# Altium schematic sheet STM32F405RGT6 .schdoc
size A4
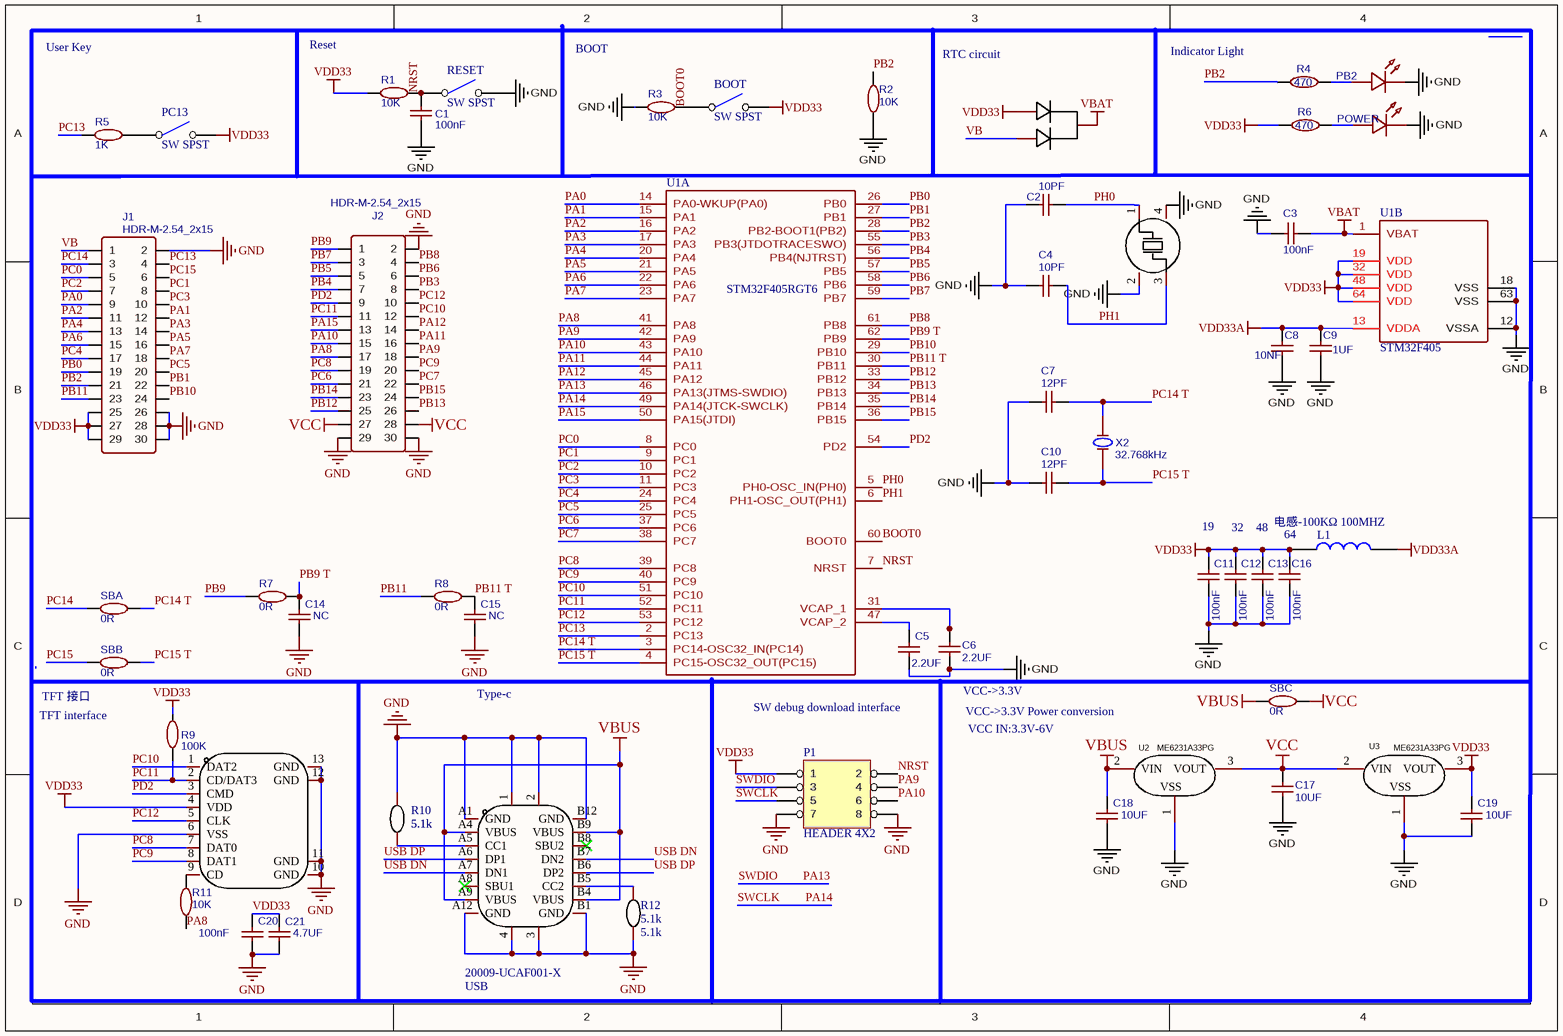
[diagram p0: STM32F405RGT6 .schdoc]

## Parts
BOOT  SW SPST  [KEY-SMD1]
C1  100nF  [C0603]
C2  10PF  [C0603]
C3  100nF  [C0603]
C4  10PF  [C0603]
C5  2.2UF  [C0603]
C6  2.2UF  [C0603]
C7  12PF  [C0603]
C8  10NF  [C0603]
C9  1UF  [C0603]
C10  12PF  [C0603]
C11  100nF  [C0603]
C12  100nF  [C0603]
C13  100nF  [C0603]
C14  NC  [C0603]
C15  NC  [C0603]
C16  100nF  [C0603]
C17  10UF  [C0603]
C18  10UF  [C0603]
C19  10UF  [C0603]
C20  100nF  [C0603]
C21  4.7UF  [C0603]
CARD1  TF-01A  [SD -TF-01A]  (value not drawn)
D1  BAT54C  [SOT-23]  (value not drawn)
J1  HDR-M-2.54_2x15  [HDR2X15-]
J2  HDR-M-2.54_2x15  [HDR2X15-]
L1  电感-100KΩ 100MHZ  [L0603]
P1  HEADER 4X2  [HDR2X4H-OK]
PB2  LED-0603_G  [LED0603-G]  (value not drawn)
PC13  SW SPST  [KEY-SMD1]
POWER  LED-0603_R  [LED0603-R]  (value not drawn)
R1  10K  [R0603]
R2  10K  [R0603]
R3  10K  [R0603]
R4  470  [R0603]
R5  1K  [R0603]
R6  470  [R0603]
R7  0R  [R0603]
R8  0R  [R0603]
R9  100K  [R0603]
R10  5.1k  [R0603]
R11  10K  [R0603]
R12  5.1k  [R0603]
RESET  SW SPST  [KEY-SMD1]
SBA  0R  [R0805]
SBB  0R  [R0805]
SBC  0R  [R0805]
U1  STM32F405RGT6  [QFP-64]  (parts A,B of 2)
U2  ME6231A33PG  [SOT-89]
U3  ME6231A33PG  [SOT-89]
USB  20009-UCAF001-X  [TYPE-C-16P]
X1  8MHz  [3225晶振]  (value not drawn)
X2  32.768kHz  [3215]

## Nets
GND: C1.1 C2.1 C3.2 C4.1 C5.1 C6.1 C7.1 C8.1 C9.1 C10.1 C11.1 C12.1 C13.1 C14.1 C15.1 C16.1 C17.2 C18.1 C19.1 C20.1 C21.1 CARD1.6(VSS) CARD1.10(GND) CARD1.11(GND) CARD1.12(GND) CARD1.13(GND) J1.2 J1.26 J1.28 J1.30 J2.2 J2.29 J2.30 P1.7 P1.8 PB2.2 POWER.2 R2.2 R3.2 R10.2 R12.2 RESET.2(NO) U1.12(VSSA) U1.18(VSS) U1.63(VSS) U2.1(VSS) U3.1(VSS) USB.1 USB.2 USB.3 USB.4 USB.A1(GND) USB.A12(GND) USB.B1(GND) USB.B12(GND) X1.2(GND) X1.4(GND)
VBAT: C3.1 D1.3(K) U1.1(VBAT)
VBUS: C18.2 SBC.2 U2.2(VIN) USB.A4(VBUS) USB.A9(VBUS) USB.B4(VBUS) USB.B9(VBUS)
VCC: C17.1 J2.27 J2.28 SBC.1 U2.3(VOUT) U3.2(VIN)
VDD33: BOOT.2(NO) C11.2 C12.2 C13.2 C16.2 C19.2 C20.2 C21.2 CARD1.4(VDD) D1.1(A1) J1.25 J1.27 J1.29 L1.1 P1.1 PC13.2(NO) R1.2 R6.1 R9.2 U1.19(VDD) U1.32(VDD) U1.48(VDD) U1.64(VDD) U3.3(VOUT)
VDD33A: C8.2 C9.2 L1.2 U1.13(VDDA)
BOOT0: BOOT.1(COMMON) R3.1 U1.60(BOOT0)
NRST: C1.2 P1.2 R1.1 RESET.1(COMMON) U1.7(NRST)
PA0: J1.9 U1.14(PA0-WKUP(PA0))
PA1: J1.12 U1.15(PA1)
PA2: J1.11 U1.16(PA2)
PA3: J1.14 U1.17(PA3)
PA4: J1.13 U1.20(PA4)
PA5: J1.16 U1.21(PA5)
PA6: J1.15 U1.22(PA6)
PA7: J1.18 U1.23(PA7)
PA8: J2.17 R11.2 U1.41(PA8)
PA9: J2.18 P1.4 U1.42(PA9)
PA10: J2.15 P1.6 U1.43(PA10)
PA11: J2.16 U1.44(PA11)
PA12: J2.14 U1.45(PA12)
PA13: P1.3 U1.46(PA13(JTMS-SWDIO))  [also labelled SWDIO]
PA14: P1.5 U1.49(PA14(JTCK-SWCLK))  [also labelled SWCLK]
PA15: J2.13 U1.50(PA15(JTDI))
PB0: J1.19 U1.26(PB0)
PB1: J1.22 U1.27(PB1)
PB2: J1.21 R2.1 R4.1 U1.28(PB2-BOOT1(PB2))
PB3: J2.8 U1.55(PB3(JTDOTRACESWO))
PB4: J2.7 U1.56(PB4(NJTRST))
PB5: J2.5 U1.57(PB5)
PB6: J2.6 U1.58(PB6)
PB7: J2.3 U1.59(PB7)
PB8: J2.4 U1.61(PB8)
PB9: J2.1 R7.2
PB9 T: C14.2 R7.1 U1.62(PB9)
PB10: J1.24 U1.29(PB10)
PB11: J1.23 R8.2
PB11 T: C15.2 R8.1 U1.30(PB11)
PB12: J2.25 U1.33(PB12)
PB13: J2.26 U1.34(PB13)
PB14: J2.23 U1.35(PB14)
PB15: J2.24 U1.36(PB15)
PC0: J1.5 U1.8(PC0)
PC1: J1.8 U1.9(PC1)
PC2: J1.7 U1.10(PC2)
PC3: J1.10 U1.11(PC3)
PC4: J1.17 U1.24(PC4)
PC5: J1.20 U1.25(PC5)
PC6: J2.21 U1.37(PC6)
PC7: J2.22 U1.38(PC7)
PC8: CARD1.7(DAT0) J2.19 U1.39(PC8)
PC9: CARD1.8(DAT1) J2.20 U1.40(PC9)
PC10: CARD1.1(DAT2) J2.12 U1.51(PC10)
PC11: CARD1.2(CD/DAT3) J2.11 R9.1 U1.52(PC11)
PC12: CARD1.5(CLK) J2.10 U1.53(PC12)
PC13: J1.4 R5.2 U1.2(PC13)
PC14: J1.3 SBA.2
PC14 T: C7.2 SBA.1 U1.3(PC14-OSC32_IN(PC14)) X2.2(OSC2)
PC15: J1.6 SBB.2
PC15 T: C10.2 SBB.1 U1.4(PC15-OSC32_OUT(PC15)) X2.1(OSC1)
PD2: CARD1.3(CMD) J2.9 U1.54(PD2)
PH0: C2.2 U1.5(PH0-OSC_IN(PH0)) X1.1(OSC1)
PH1: C4.2 U1.6(PH1-OSC_OUT(PH1)) X1.3(OSC2)
USB DN: USB.A7(DN1) USB.B7(DN2)
USB DP: USB.A6(DP1) USB.B6(DP2)
VB: D1.2(A2) J1.1
NetC5_2: C5.2 U1.47(VCAP_2)
NetC6_2: C6.2 U1.31(VCAP_1)
NetCARD1_9: CARD1.9(CD) R11.1
NetPB2_1: PB2.1 R4.2
NetPC13_1: PC13.1(COMMON) R5.1
NetPOWER_1: POWER.1 R6.2
NetR10_1: R10.1 USB.A5(CC1)
NetR12_1: R12.1 USB.B5(CC2)

Not connected (* = marked no-connect by the designer): USB A8(SBU1)* B8(SBU2)*

## Notes on the sheet
- User Key
- Reset
- BOOT
- RTC circuit
- (near R4) Indicator Light
- 19
- 32
- 48
- 64
- TFT interface
- (near SBB) TFT 接口
- Type-c
- SW debug download interface
- (near C6) VCC->3.3V
- VCC->3.3V Power conversion
- VCC IN:3.3V-6V

## Library data of the parts
C1 C3 C5 C6 C8 C9 C11-C21 = 100nF: Manufacturer: FH; Manufacturer Part: 0603B104K500NT; nameAlias: Capacitance; Supplier: LCSC; Supplier Part: C30926; JLCPCB Part Class: Extended Part; spicePre: C; spiceSymbolName: 0603B104K500NT
C2 C4 C7 C10 = 20pF: Manufacturer: YAGEO; Manufacturer Part: CC0603JRNPO9BN200; nameAlias: Capacitance; Supplier: LCSC; Supplier Part: C105621; JLCPCB Part Class: Extended Part; spicePre: C; spiceSymbolName: CC0603JRNPO9BN200
CARD1 = TF-01A_C2889258: Manufacturer: Yuandi(元迪); Add into BOM: yes; Card Connection Mode: 自弹式; Card Type: MicroSD卡(TF卡); Connector Type: 卡座; Maximum Body Height: 2mm; Name: TF-01A; Symbol: TF-01A_C2889258; Device: TF-01A_C2889258; LCSC Part Name: 自弹式 MicroSD卡(TF卡) 卡座; Supplier Part: C2889258; Manufacturer Part: TF-01A; Supplier Footprint: SMD; JLCPCB Part Class: Extended Part; Datasheet: https://atta.szlcsc.com/upload/public/pdf/source/20210830/44259D2B93BF4B637A446EF1520C4989.pdf; Supplier: LCSC; Convert to PCB: yes; Operating Temperature Range: -
D1 = BAT54C_C2135: Manufacturer: CJ(江苏长电/长晶); Add into BOM: yes; Forward Voltage (Vf@If): 1V@100mA; Reverse Voltage (Vr): 30V; Average Rectified Current (Io): 200mA; Name: BAT54C; Symbol: BAT54C; Device: BAT54C_C2135; LCSC Part Name: 电压:30V 电流:200mA; Supplier Part: C2135; Manufacturer Part: BAT54C; Supplier Footprint: SOT-23; JLCPCB Part Class: Extended Part; Datasheet: https://atta.szlcsc.com/upload/public/pdf/source/20140809/1457707206468.pdf; Supplier: LCSC; Convert to PCB: yes; Diode Configuration: -; Reverse Leakage Current (Ir): -
J1 J2 = HDR-M-2.54_2x15: Contributor: LCEDA_Lib; Supplier Part: C56496; Supplier: LCSC; spicePre: J; spiceSymbolName: HDR-M-2.54_2x15
L1 = 电感
PB2 POWER = LED-0603_R: Manufacturer: EVERLIGHT(台湾亿光); Manufacturer Part: 19-217/R6C-AL1M2VY/3T; Contributor: LCEDA_01; Supplier Part: C72044; Supplier: LCSC; spicePre: L; spiceSymbolName: LED-0603_R
R1-R3 R5 R7-R9 R11 SBA SBB SBC = 10K: Manufacturer: YAGEO; Manufacturer Part: RC0603FR-0710KL; nameAlias: Resistance (Ohms); Supplier: LCSC; Supplier Part: C98220; JLCPCB Part Class: Extended Part; spicePre: R; spiceSymbolName: RC0603FR-0710KL
R4 R6 = 470: Manufacturer: UniOhm; Manufacturer Part: 0603WAJ0471T5E; nameAlias: Resistance (Ohms); Supplier: LCSC; Supplier Part: C25241; JLCPCB Part Class: Extended Part; spicePre: R; spiceSymbolName: 0603WAJ0471T5E
R10 R12 = 5.1k: Convert to PCB: yes; Name: 5.1k; Symbol: 5.1k; Device: 5.1k; Add into BOM: yes; Origin Footprint: R0603
U1 = STM32F405
U2 U3 = ME6231A33PG: Manufacturer: MICRONE(南京微盟); Add into BOM: yes; Name: ME6231A33PG; Symbol: ME6231A33PG; Device: ME6231A33PG; LCSC Part Name: ME6231A33PG; Supplier Part: C2681684; Manufacturer Part: ME6231A33PG; Supplier Footprint: SOT-89-3; JLCPCB Part Class: Extended Part; Datasheet: https://atta.szlcsc.com/upload/public/pdf/source/20210120/C2681684_337AAD97646491644A783A381C81CF83.pdf; Supplier: LCSC; Convert to PCB: yes; Output Type: -
USB = 20009-UCAF001-X: Manufacturer: MINTRON(��˶); Add into BOM: yes; Name: 20009-UCAF001-X; Symbol: 20009-UCAF001-X; Device: 20009-UCAF001-X; LCSC Part Name: TYPE C; Supplier Part: C3148200; Manufacturer Part: 20009-UCAF001-X; Supplier Footprint: SMD; JLCPCB Part Class: ��չ��; Datasheet: https://atta.szlcsc.com/upload/public/pdf/source/20220705/4C04992B6F70FB490BC74B4779796E6C.pdf; Supplier: LCSC; Convert to PCB: yes
X1 = X322525MOB4SI: C20617566; Manufacturer: YXC(扬兴晶振); Name: 25MHz; Add into BOM: yes; Crystal Type: 贴片晶振; Value: 25MHz; Normal temperature Frequency Tolerance: ±10ppm; External load capacitor: 12pF; Frequency Stability(Full temperature range): ±20ppm; Symbol: X322525MOB4SI; Device: X322525MOB4SI; LCSC Part Name: 25MHz ±10ppm 12pF; Supplier Part: C9006; Manufacturer Part: X322525MOB4SI; Supplier Footprint: SMD3225-4P; JLCPCB Part Class: Basic Part; Datasheet: https://atta.szlcsc.com/upload/public/pdf/source/20240329/19D5F850207469550BEB00D7DFEDBC7A.pdf; Supplier: LCSC; Convert to PCB: yes; Operating Temperature: -40℃~+85℃
X2 = 32.768kHz: Manufacturer Part: X308032768KGB2SC; Manufacturer: YXC(扬兴晶振); nameAlias: Value; Supplier: LCSC; Supplier Part: C52082; JLCPCB Part Class: Extended Part; link: https://so.szlcsc.com/global.html?k=C52082&ref=editor; spicePre: X; spiceSymbolName: X308032768KGB2SC